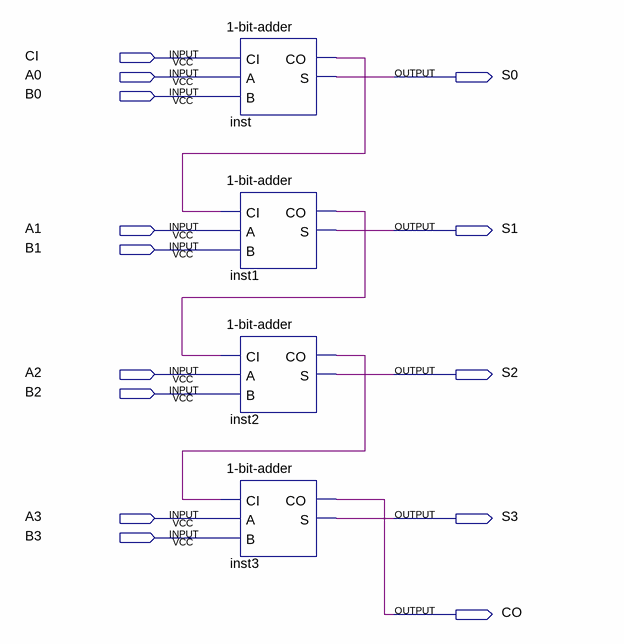
[diagram p0: schematic sheet]
// Quartus schematic 4-bit-adder.bdf as structural Verilog: 4 symbols, 14 pins
module \4-bit-adder  (
  input  CI,
  input  A0,
  input  B0,
  input  A1,
  input  B1,
  input  A2,
  input  B2,
  input  A3,
  input  B3,
  output S0,
  output S1,
  output S2,
  output S3,
  output CO
);

  wire inst1_co, inst2_co, inst_co;

  \1-bit-adder  inst (.CI(CI), .A(A0), .B(B0), .CO(inst_co), .S(S0));
  \1-bit-adder  inst1 (.CI(inst_co), .A(A1), .B(B1), .CO(inst1_co), .S(S1));
  \1-bit-adder  inst2 (.CI(inst1_co), .A(A2), .B(B2), .CO(inst2_co), .S(S2));
  \1-bit-adder  inst3 (.CI(inst2_co), .A(A3), .B(B3), .CO(CO), .S(S3));
endmodule
